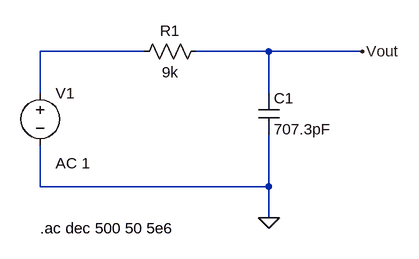
[diagram p0: schematic exercise3_assignment3.asc]
exercise3_assignment3.asc, the LTspice schematic file:
Version 4
SHEET 1 880 680
WIRE 176 64 16 64
WIRE 368 64 256 64
WIRE 512 64 368 64
WIRE 16 128 16 64
WIRE 368 128 368 64
WIRE 16 272 16 208
WIRE 368 272 368 192
WIRE 368 272 16 272
WIRE 368 320 368 272
FLAG 368 320 0
FLAG 512 64 Vout
SYMBOL voltage 16 112 R0
WINDOW 123 24 124 Left 2
WINDOW 39 0 0 Left 0
SYMATTR InstName V1
SYMATTR Value ""
SYMATTR Value2 AC 1
SYMBOL res 272 48 R90
WINDOW 0 0 56 VBottom 2
WINDOW 3 32 56 VTop 2
SYMATTR InstName R1
SYMATTR Value 9k
SYMBOL cap 352 128 R0
SYMATTR InstName C1
SYMATTR Value 707.3pF
TEXT 16 336 Left 2 !.ac dec 500 50 5e6

The netlist it stands for:
* exercise3_assignment3.asc
V1 N001 0 AC 1
R1 Vout N001 9k
C1 Vout 0 707.3pF
.ac dec 500 50 5e6
.backanno
.end